# Altium project My_Project.PrjPcb
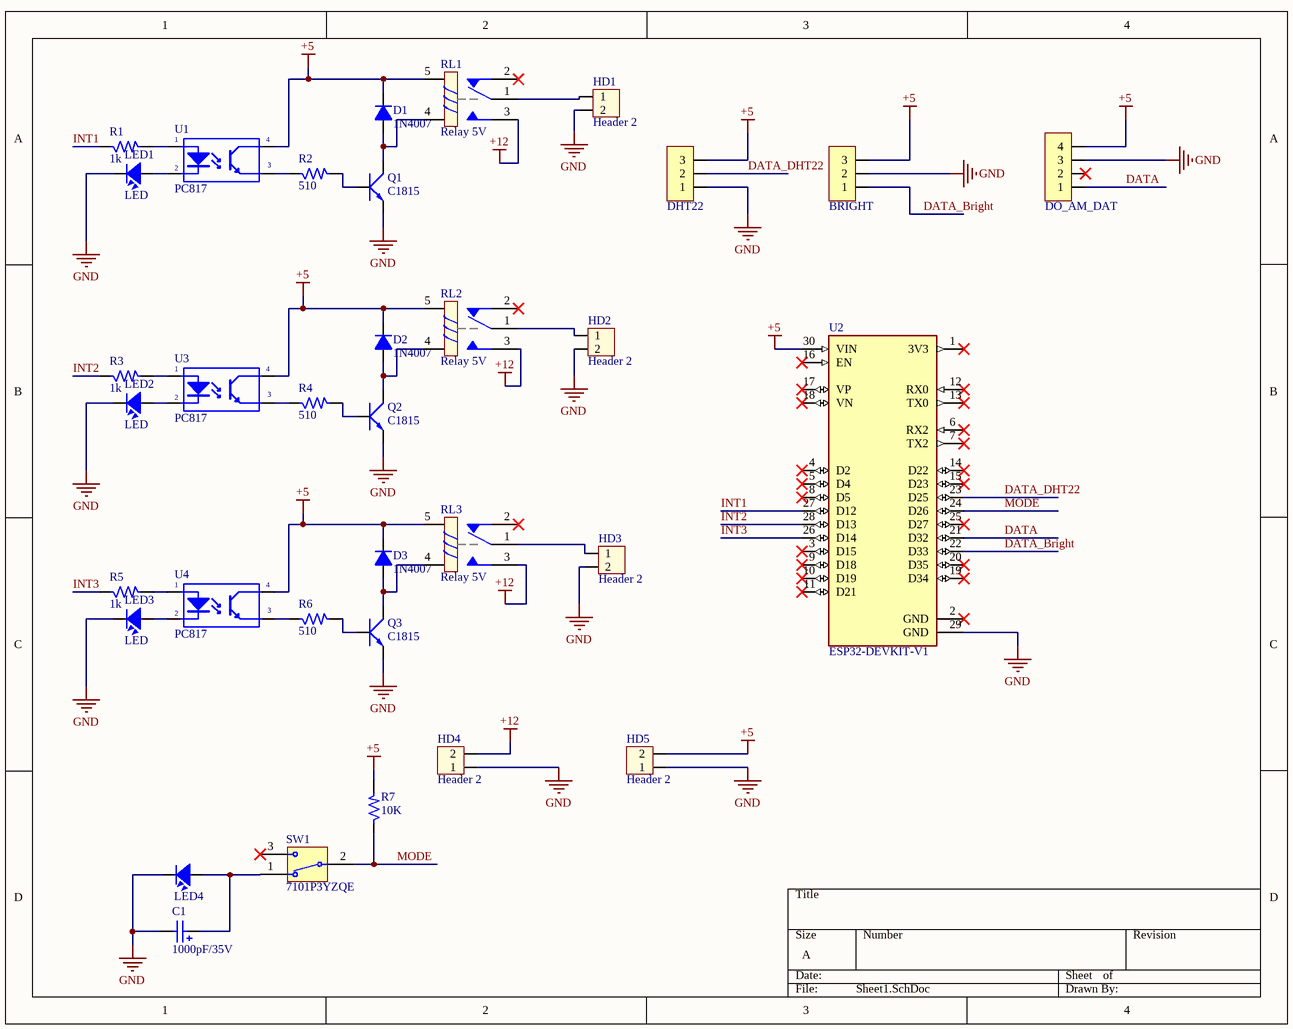
[diagram p0: Sheet1.SchDoc]
1 sheet, 34 parts. Net scope: global (net labels, ports and power ports of the same name join across sheets).
Board file: PCB1.PcbDoc

## Sheet Sheet1.SchDoc
size A; SheetNumber: 1; SheetTotal: 1

### Parts
C1  value 1000pF/35V  [CP2/5]  (hidden comment: Cap Pol3)
D1  1N4007  [D2A]
D2  1N4007  [D2A]
D3  1N4007  [D2A]
HD1  Header 2  [HED2]
HD2  Header 2  [HED2]
HD3  Header 2  [HED2]
HD4  Header 2  [HED2]
HD5  Header 2  [HED2]
JP1  DO_AM_DAT  [JP 1x4 CT]
JP2  DHT22  [JP 1x3 CT]
JP3  BRIGHT  [JP 1x3 CT]
LED1  LED  [LED-5TRED]
LED2  LED  [LED-5TRED]
LED3  LED  [LED-5TRED]
LED4  LED  [LED-5-RED]  (value not drawn)
Q1  C1815  [QTO-92]
Q2  C1815  [QTO-92]
Q3  C1815  [QTO-92]
R1  1k  [DIEN TRO 1/4 W]
R2  510  [DIEN TRO 1/4 W]
R3  1k  [DIEN TRO 1/4 W]
R4  510  [DIEN TRO 1/4 W]
R5  1k  [DIEN TRO 1/4 W]
R6  510  [DIEN TRO 1/4 W]
R7  10K  [DIEN TRO 1/4 W]
RL1  Relay 5V  [RL_SPDT_10A]
RL2  Relay 5V  [RL_SPDT_10A]
RL3  Relay 5V  [RL_SPDT_10A]
SW1  7101P3YZQE  [SW_TOGGLE_7101P3YZQE]
U1  PC817  [DIP4/W0.3]
U2  ESP32-DEVKIT-V1  [MODULE_ESP32_DEVKIT_V1]
U3  PC817  [DIP4/W0.3]
U4  PC817  [DIP4/W0.3]

### Nets
+5: D1.2(K) D2.2(K) D3.2(K) HD5.2 JP1.4 JP2.3 JP3.3 R7.2 RL1.5 RL2.5 RL3.5 U1.4(C) U2.30(VIN) U3.4(C) U4.4(C)
+12: HD4.2 RL1.3 RL2.3 RL3.3
GND: C1.2 HD1.2 HD2.2 HD3.2 HD4.1 HD5.1 JP1.3 JP2.1 JP3.2 LED1.2 LED2.2 LED3.2 LED4.2 Q1.1(E) Q2.1(E) Q3.1(E) U2.29(GND)
DATA: JP1.1 U2.21(D32)
DATA_Bright: JP3.1 U2.22(D33)
DATA_DHT22: JP2.2 U2.23(D25)
INT1: R1.1 U2.27(D12)
INT2: R3.1 U2.28(D13)
INT3: R5.1 U2.26(D14)
MODE: R7.1 SW1.2(COM) U2.24(D26)
NetC1_1: C1.1 LED4.1 SW1.1(NC)
NetD1_1: D1.1(A) Q1.2(C) RL1.4
NetD2_1: D2.1(A) Q2.2(C) RL2.4
NetD3_1: D3.1(A) Q3.2(C) RL3.4
NetHD1_1: HD1.1 RL1.1
NetHD2_1: HD2.1 RL2.1
NetHD3_1: HD3.1 RL3.1
NetLED1_1: LED1.1 U1.2(K)
NetLED2_1: LED2.1 U3.2(K)
NetLED3_1: LED3.1 U4.2(K)
NetQ1_3: Q1.3(B) R2.2
NetQ2_3: Q2.3(B) R4.2
NetQ3_3: Q3.3(B) R6.2
NetR1_2: R1.2 U1.1(A)
NetR2_1: R2.1 U1.3(E)
NetR3_2: R3.2 U3.1(A)
NetR4_1: R4.1 U3.3(E)
NetR5_2: R5.2 U4.1(A)
NetR6_1: R6.1 U4.3(E)

Not connected (* = marked no-connect by the designer): JP1 2*; RL1 2*; RL2 2*; RL3 2*; SW1 3(NO)*; U2 1(3V3)* 2(GND)* 3(D15)* 4(D2)* 5(D4)* 6(RX2)* 7(TX2)* 8(D5)* 9(D18)* 10(D19)* 11(D21)* 12(RX0)* 13(TX0)* 14(D22)* 15(D23)* 16(EN)* 17(VP)* 18(VN)* 19(D34)* 20(D35)* 25(D27)*

### Library data of the parts
C1 = Cap Pol3: Polarized Capacitor (Surface Mount); VALUE: C?; LatestRevisionDate: 17-Jul-2002; LatestRevisionNote: Re-released for DXP Platform.; PackageReference: C0805; Publisher: Altium Limited
D1-D3 = D1A: Diode 1A; Value: 1N4007
HD1-HD5 = Hed2: Header 2 (Green); Value: Header 2
JP1 = JP 1x4 2.54 Cai Thang: Cắm; Ten_Linh_Kien: Jump Đơn Cái 2.54MM 1x20P Thẳng; Don_Vi: Con; Ma_Hang: MH004006; Ghi_Chu: *; Kieu_Chan: *; Chung_Loai: Cắm
JP2 JP3 = JP 1x3 2.54 Cai Thang: Cắm; Ten_Linh_Kien: Jump Đơn Cái 2.54MM 1x20P Thẳng; Don_Vi: Con; Ma_Hang: MH004006; Ghi_Chu: *; Kieu_Chan: *; Chung_Loai: Cắm
LED1-LED4 = LED: LED Single colour Green and Red; Value: LED 3 ly Single Colour
Q1-Q3 = C1815: NPN 600mW, ECB; Value: C1815
R1-R7 = Res: Resistor 1/4W; Value: R1/4W - 1K
RL1-RL3 = Relay 1: Relay SPDT,10A - 12VDC 5 Pin; Value: Relay SPDT, 10A, 12V
SW1 = SW_TOGGLE_7101P3YZQE: SWITCH TOGGLE SPDT 5A 120V; Manufacturer: C&K; Switch Function: On-On; Current Rating: 5A (AC/DC); Voltage Rating - DC: 28V; Actuator Type: Flat Anti-Rotation; Actuator Length: 11.43mm; Illumination: Non-Illuminated; Actuator Material: Brass, Chrome Plated; Electrical Life: 100,000 Cycles; Supplier 1: Digi-Key; Manufacturer Part Number: 7101P3YZQE; RoHS: RoHS Compliant; Category: Switches; Stock 1: 933; Pricing 1: 1=6.11, 10=5.801, 25=5.648, 50=5.4954, 100=5.3428, 250=5.03744, 500=4.2742, 1000=4.04523 (USD); Packaging: Bulk; Part Status: Active; Circuit: SPDT; Voltage Rating - AC: 120V; Illumination Type, Color: -; Illumination Voltage (Nominal): -; Mounting Type: Panel Mount; Termination Style: Solder Lug; Panel Cutout Dimensions: Circular - 6.35mm Dia; Bushing Thread: 1/4-40; Ingress Protection: -; Features: Epoxy Sealed Terminals; Operating Temperature: -30°C ~ 85°C; ComponentLink1URL: http://www.ckswitches.com/media/1394/7000toggle.pdf; ComponentLink1Description: http://www.ckswitches.com/media/1394/7000toggle.pdf; Supplier Part Number 1: CKN1019-ND
U1 U3 U4 = PC817: Single Opto; Value: PC817
U2 = ESP32-DEVKIT-V1: Dual core, Wi-Fi: 2.4 GHz up to 150 Mbits/s,BLE (Bluetooth Low Energy) and legacy Bluetooth, 32 bits, Up to 240 MHz; MF: Do it; Value: *; MP: ESP32-DEVKIT-V1; SnapEDA_Link: https://www.snapeda.com/parts/ESP32-DEVKIT-V1/Do+it/view-part/?ref=snap; Price: None; Package: None; Check_prices: https://www.snapeda.com/parts/ESP32-DEVKIT-V1/Do+it/view-part/?ref=eda; Availability: Not in stock